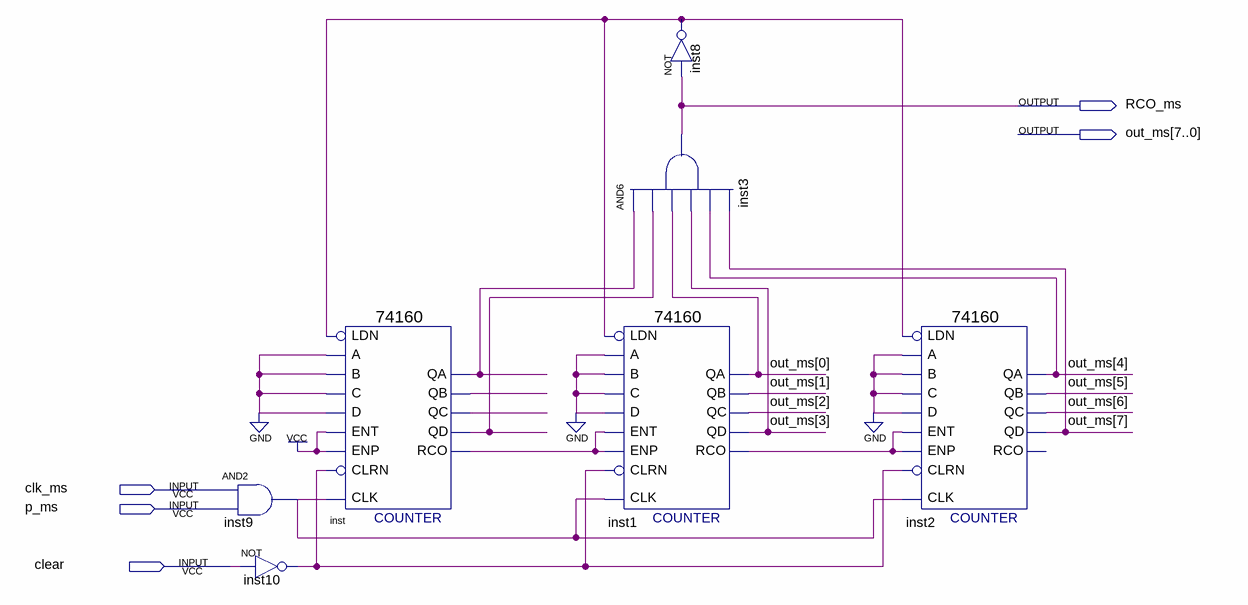
[diagram p0: schematic sheet]
// Quartus schematic out_ms.bdf as structural Verilog: 7 symbols, 5 pins
module out_ms (
  input  clk_ms,
  input  p_ms,
  input  clear,
  output RCO_ms,
  output [7:0] out_ms
);

  wire inst1_rco, inst8_out, inst9_out, inst10_out, inst_qa, inst_qb, inst_qc, inst_qd, inst_rco;

  and inst9 (inst9_out, clk_ms, p_ms);
  not inst10 (inst10_out, clear);
  \74160  inst (
    .CLK(inst9_out), .ENT(1'b1), .A(1'b0), .B(1'b0), .C(1'b0), .D(1'b0), .LDN(inst8_out), .ENP(1'b1),
    .CLRN(inst10_out), .QD(inst_qd), .QA(inst_qa), .QB(inst_qb), .QC(inst_qc), .RCO(inst_rco));
  not inst8 (inst8_out, RCO_ms);
  and inst3 (RCO_ms, inst_qa, inst_qd, out_ms[0], out_ms[3], out_ms[4], out_ms[7]);
  \74160  inst1 (
    .CLK(inst9_out), .ENT(inst_rco), .A(1'b0), .B(1'b0), .C(1'b0), .D(1'b0), .LDN(inst8_out), .ENP(inst_rco),
    .CLRN(inst10_out), .QD(out_ms[3]), .QA(out_ms[0]), .QB(out_ms[1]), .QC(out_ms[2]), .RCO(inst1_rco));
  \74160  inst2 (
    .CLK(inst9_out), .ENT(inst1_rco), .A(1'b0), .B(1'b0), .C(1'b0), .D(1'b0), .LDN(inst8_out),
    .ENP(inst1_rco), .CLRN(inst10_out), .QD(out_ms[7]), .QA(out_ms[4]), .QB(out_ms[5]), .QC(out_ms[6]));  // open: RCO
endmodule
